# Altium schematic sheet 1_P1.schdoc
size 604 x 431 mm; Symbol: Sheet-Symbol_A4; Device: Sheet-Symbol_A4; Company: Keep-PCB-safe; Version: V1.0; Page Size: A2; @Project Name: 单片机教程-键盘; @Page Count: 1; @Update Date: 2022-11-01; @Create Date: 2022-11-01; @Schematic Name: Schematic1; @Page No: 1; @Page Name: P1
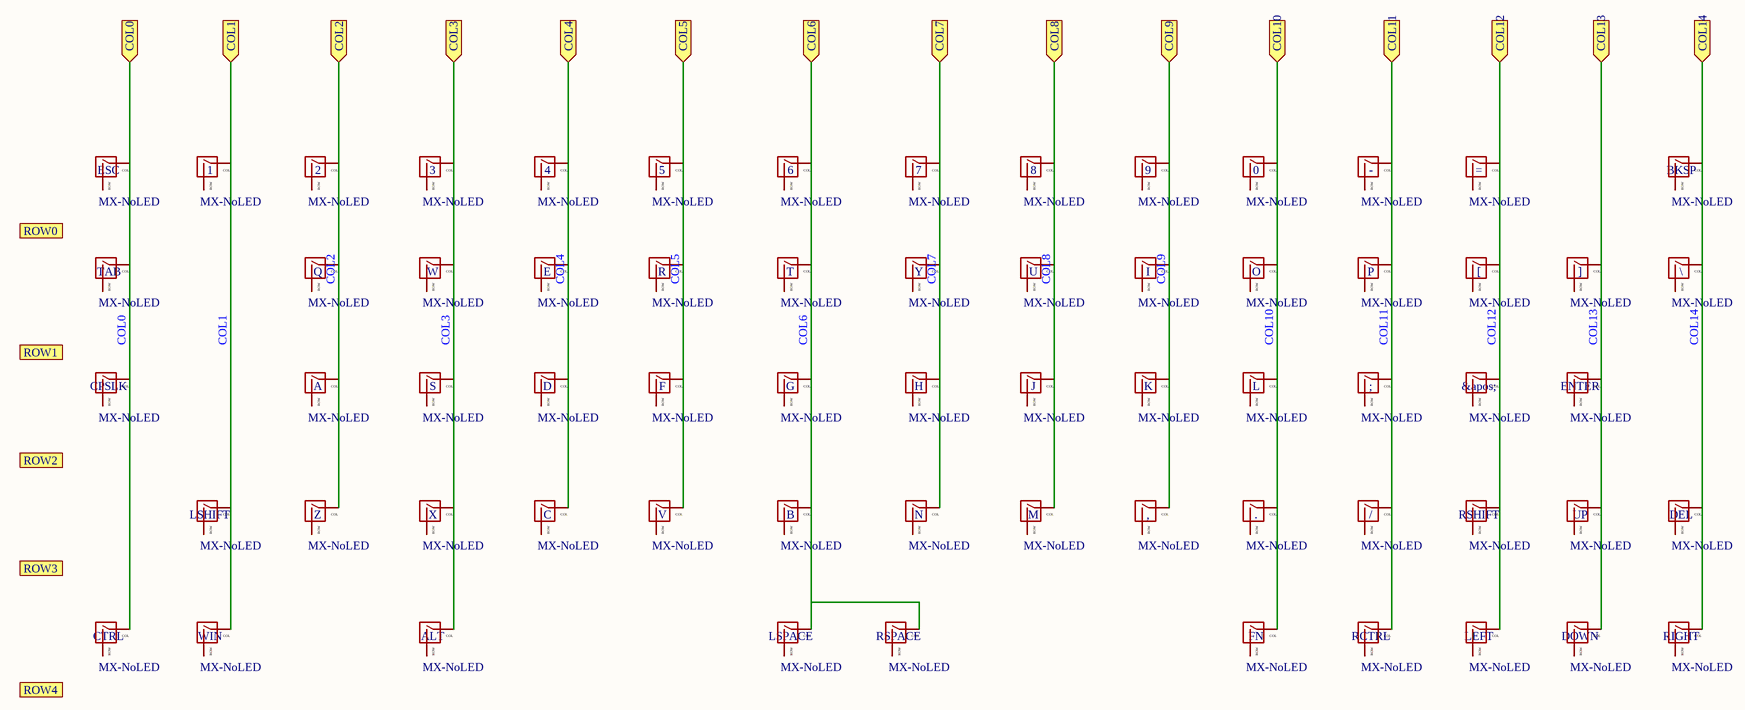
[diagram p0: 1_P1.schdoc]

## Parts
0  MX-无LED  [MX_ALPS_HYBRID:MXONLY-1U]  (value not drawn)
1  MX-无LED  [MX_ALPS_HYBRID:MXONLY-1U]  (value not drawn)
2  MX-无LED  [MX_ALPS_HYBRID:MXONLY-1U]  (value not drawn)
3  MX-无LED  [MX_ALPS_HYBRID:MXONLY-1U]  (value not drawn)
4  MX-无LED  [MX_ALPS_HYBRID:MXONLY-1U]  (value not drawn)
5  MX-无LED  [MX_ALPS_HYBRID:MXONLY-1U]  (value not drawn)
6  MX-无LED  [MX_ALPS_HYBRID:MXONLY-1U]  (value not drawn)
7  MX-无LED  [MX_ALPS_HYBRID:MXONLY-1U]  (value not drawn)
8  MX-无LED  [MX_ALPS_HYBRID:MXONLY-1U]  (value not drawn)
9  MX-无LED  [MX_ALPS_HYBRID:MXONLY-1U]  (value not drawn)
&apos;  MX-无LED  [MX_ALPS_HYBRID:MXONLY-1U]  (value not drawn)
,  MX-无LED  [MX_ALPS_HYBRID:MXONLY-1U]  (value not drawn)
-  MX-无LED  [MX_ALPS_HYBRID:MXONLY-1U]  (value not drawn)
.  MX-无LED  [MX_ALPS_HYBRID:MXONLY-1U]  (value not drawn)
/  MX-无LED  [MX_ALPS_HYBRID:MXONLY-1U]  (value not drawn)
;  MX-无LED  [MX_ALPS_HYBRID:MXONLY-1U]  (value not drawn)
=  MX-无LED  [MX_ALPS_HYBRID:MXONLY-1U]  (value not drawn)
[  MX-无LED  [MX_ALPS_HYBRID:MXONLY-1U]  (value not drawn)
\  MX-无LED  [MX_ALPS_HYBRID:MXONLY-1U]  (value not drawn)
]  MX-无LED  [MX_ALPS_HYBRID:MXONLY-1U]  (value not drawn)
A  MX-无LED  [MX_ALPS_HYBRID:MXONLY-1U]  (value not drawn)
ALT  MX-无LED  [MX_ALPS_HYBRID:MXONLY-1U]  (value not drawn)
B  MX-无LED  [MX_ALPS_HYBRID:MXONLY-1U]  (value not drawn)
BKSP  MX-无LED  [MX_ALPS_HYBRID:MXONLY-1U]  (value not drawn)
C  MX-无LED  [MX_ALPS_HYBRID:MXONLY-1U]  (value not drawn)
CPSLK  MX-无LED  [MX_ALPS_HYBRID:MXONLY-1U]  (value not drawn)
CTRL  MX-无LED  [MX_ALPS_HYBRID:MXONLY-1U]  (value not drawn)
D  MX-无LED  [MX_ALPS_HYBRID:MXONLY-1U]  (value not drawn)
DEL  MX-无LED  [MX_ALPS_HYBRID:MXONLY-1U]  (value not drawn)
DOWN  MX-无LED  [MX_ALPS_HYBRID:MXONLY-1U]  (value not drawn)
E  MX-无LED  [MX_ALPS_HYBRID:MXONLY-1U]  (value not drawn)
ENTER  MX-无LED  [MX_ALPS_HYBRID:MXONLY-1U]  (value not drawn)
ESC  MX-无LED  [MX_ALPS_HYBRID:MXONLY-1U]  (value not drawn)
F  MX-无LED  [MX_ALPS_HYBRID:MXONLY-1U]  (value not drawn)
FN  MX-无LED  [MX_ALPS_HYBRID:MXONLY-1U]  (value not drawn)
G  MX-无LED  [MX_ALPS_HYBRID:MXONLY-1U]  (value not drawn)
H  MX-无LED  [MX_ALPS_HYBRID:MXONLY-1U]  (value not drawn)
I  MX-无LED  [MX_ALPS_HYBRID:MXONLY-1U]  (value not drawn)
J  MX-无LED  [MX_ALPS_HYBRID:MXONLY-1U]  (value not drawn)
K  MX-无LED  [MX_ALPS_HYBRID:MXONLY-1U]  (value not drawn)
L  MX-无LED  [MX_ALPS_HYBRID:MXONLY-1U]  (value not drawn)
LEFT  MX-无LED  [MX_ALPS_HYBRID:MXONLY-1U]  (value not drawn)
LSHIFT  MX-无LED  [MX_ALPS_HYBRID:MXONLY-1U]  (value not drawn)
LSPACE  MX-无LED  [MX_ALPS_HYBRID:MXONLY-1U]  (value not drawn)
M  MX-无LED  [MX_ALPS_HYBRID:MXONLY-1U]  (value not drawn)
N  MX-无LED  [MX_ALPS_HYBRID:MXONLY-1U]  (value not drawn)
O  MX-无LED  [MX_ALPS_HYBRID:MXONLY-1U]  (value not drawn)
P  MX-无LED  [MX_ALPS_HYBRID:MXONLY-1U]  (value not drawn)
Q  MX-无LED  [MX_ALPS_HYBRID:MXONLY-1U]  (value not drawn)
R  MX-无LED  [MX_ALPS_HYBRID:MXONLY-1U]  (value not drawn)
RCTRL  MX-无LED  [MX_ALPS_HYBRID:MXONLY-1U]  (value not drawn)
RIGHT  MX-无LED  [MX_ALPS_HYBRID:MXONLY-1U]  (value not drawn)
RSHIFT  MX-无LED  [MX_ALPS_HYBRID:MXONLY-1U]  (value not drawn)
RSPACE  MX-无LED  [MX_ALPS_HYBRID:MXONLY-1U]  (value not drawn)
S  MX-无LED  [MX_ALPS_HYBRID:MXONLY-1U]  (value not drawn)
T  MX-无LED  [MX_ALPS_HYBRID:MXONLY-1U]  (value not drawn)
TAB  MX-无LED  [MX_ALPS_HYBRID:MXONLY-1U]  (value not drawn)
U  MX-无LED  [MX_ALPS_HYBRID:MXONLY-1U]  (value not drawn)
UP  MX-无LED  [MX_ALPS_HYBRID:MXONLY-1U]  (value not drawn)
V  MX-无LED  [MX_ALPS_HYBRID:MXONLY-1U]  (value not drawn)
W  MX-无LED  [MX_ALPS_HYBRID:MXONLY-1U]  (value not drawn)
WIN  MX-无LED  [MX_ALPS_HYBRID:MXONLY-1U]  (value not drawn)
X  MX-无LED  [MX_ALPS_HYBRID:MXONLY-1U]  (value not drawn)
Y  MX-无LED  [MX_ALPS_HYBRID:MXONLY-1U]  (value not drawn)
Z  MX-无LED  [MX_ALPS_HYBRID:MXONLY-1U]  (value not drawn)

## Ports
COL0 (in), COL1 (in), COL2 (in), COL3 (in), COL4 (in), COL5 (in), COL6 (in), COL7 (in), COL8 (in), COL9 (in), COL10 (in), COL11 (in), COL12 (in), COL13 (in), COL14 (in), ROW0 (in), ROW1 (in), ROW2 (in), ROW3 (in), ROW4 (in)

## Nets
COL0: CPSLK.1(COL) CTRL.1(COL) ESC.1(COL) TAB.1(COL) ; port COL0
COL1: 1.1(COL) LSHIFT.1(COL) WIN.1(COL) ; port COL1
COL2: 2.1(COL) A.1(COL) Q.1(COL) Z.1(COL) ; port COL2
COL3: 3.1(COL) ALT.1(COL) S.1(COL) W.1(COL) X.1(COL) ; port COL3
COL4: 4.1(COL) C.1(COL) D.1(COL) E.1(COL) ; port COL4
COL5: 5.1(COL) F.1(COL) R.1(COL) V.1(COL) ; port COL5
COL6: 6.1(COL) B.1(COL) G.1(COL) LSPACE.1(COL) RSPACE.1(COL) T.1(COL) ; port COL6
COL7: 7.1(COL) H.1(COL) N.1(COL) Y.1(COL) ; port COL7
COL8: 8.1(COL) J.1(COL) M.1(COL) U.1(COL) ; port COL8
COL9: 9.1(COL) ,.1(COL) I.1(COL) K.1(COL) ; port COL9
COL10: 0.1(COL) ..1(COL) FN.1(COL) L.1(COL) O.1(COL) ; port COL10
COL11: -.1(COL) /.1(COL) ;.1(COL) P.1(COL) RCTRL.1(COL) ; port COL11
COL12: &apos;.1(COL) =.1(COL) [.1(COL) LEFT.1(COL) RSHIFT.1(COL) ; port COL12
COL13: ].1(COL) DOWN.1(COL) ENTER.1(COL) UP.1(COL) ; port COL13
COL14: \.1(COL) BKSP.1(COL) DEL.1(COL) RIGHT.1(COL) ; port COL14

Not connected (* = marked no-connect by the designer): 0 2(ROW); 1 2(ROW); 2 2(ROW); 3 2(ROW); 4 2(ROW); 5 2(ROW); 6 2(ROW); 7 2(ROW); 8 2(ROW); 9 2(ROW); &apos; 2(ROW); , 2(ROW); - 2(ROW); . 2(ROW); / 2(ROW); ; 2(ROW); = 2(ROW); [ 2(ROW); \ 2(ROW); ] 2(ROW); A 2(ROW); ALT 2(ROW); B 2(ROW); BKSP 2(ROW); C 2(ROW); CPSLK 2(ROW); CTRL 2(ROW); D 2(ROW); DEL 2(ROW); DOWN 2(ROW); E 2(ROW); ENTER 2(ROW); ESC 2(ROW); F 2(ROW); FN 2(ROW); G 2(ROW); H 2(ROW); I 2(ROW); J 2(ROW); K 2(ROW); L 2(ROW); LEFT 2(ROW); LSHIFT 2(ROW); LSPACE 2(ROW); M 2(ROW); N 2(ROW); O 2(ROW); P 2(ROW); Q 2(ROW); R 2(ROW); RCTRL 2(ROW); RIGHT 2(ROW); RSHIFT 2(ROW); RSPACE 2(ROW); S 2(ROW); T 2(ROW); TAB 2(ROW); U 2(ROW); UP 2(ROW); V 2(ROW); W 2(ROW); WIN 2(ROW); X 2(ROW); Y 2(ROW); Z 2(ROW)

## Notes on the sheet
- 1
- 2
- 3
- 4
- 5
- 6
- A
- B
- C
- D
- Schematic
- Page
- Schematic1
- P1
- Create Date
- Part Number
- Update Date
- 2022-11-01
- Reviewed
- Drawed
- 单片机教程-键盘
- VER
- SIZE
- PAGE
- OF
- V1.0
- A2
- Keep-PCB-safe

## Library data of the parts
0-9 &apos; , - . / ; = [ \ ] A ALT B BKSP C CPSLK CTRL D DEL DOWN E ENTER ESC F FN G H I J K L LEFT LSHIFT LSPACE M N O P Q R RCTRL RIGHT RSHIFT RSPACE S T TAB U UP V W WIN X Y Z = MX-无LED: Symbol: MX-NoLED; Value: MX-NoLED; Add into BOM: yes; Device: MX-无LED; Convert to PCB: yes